# EAGLE schematic Schematic v39 (EAGLE 9.7.0)
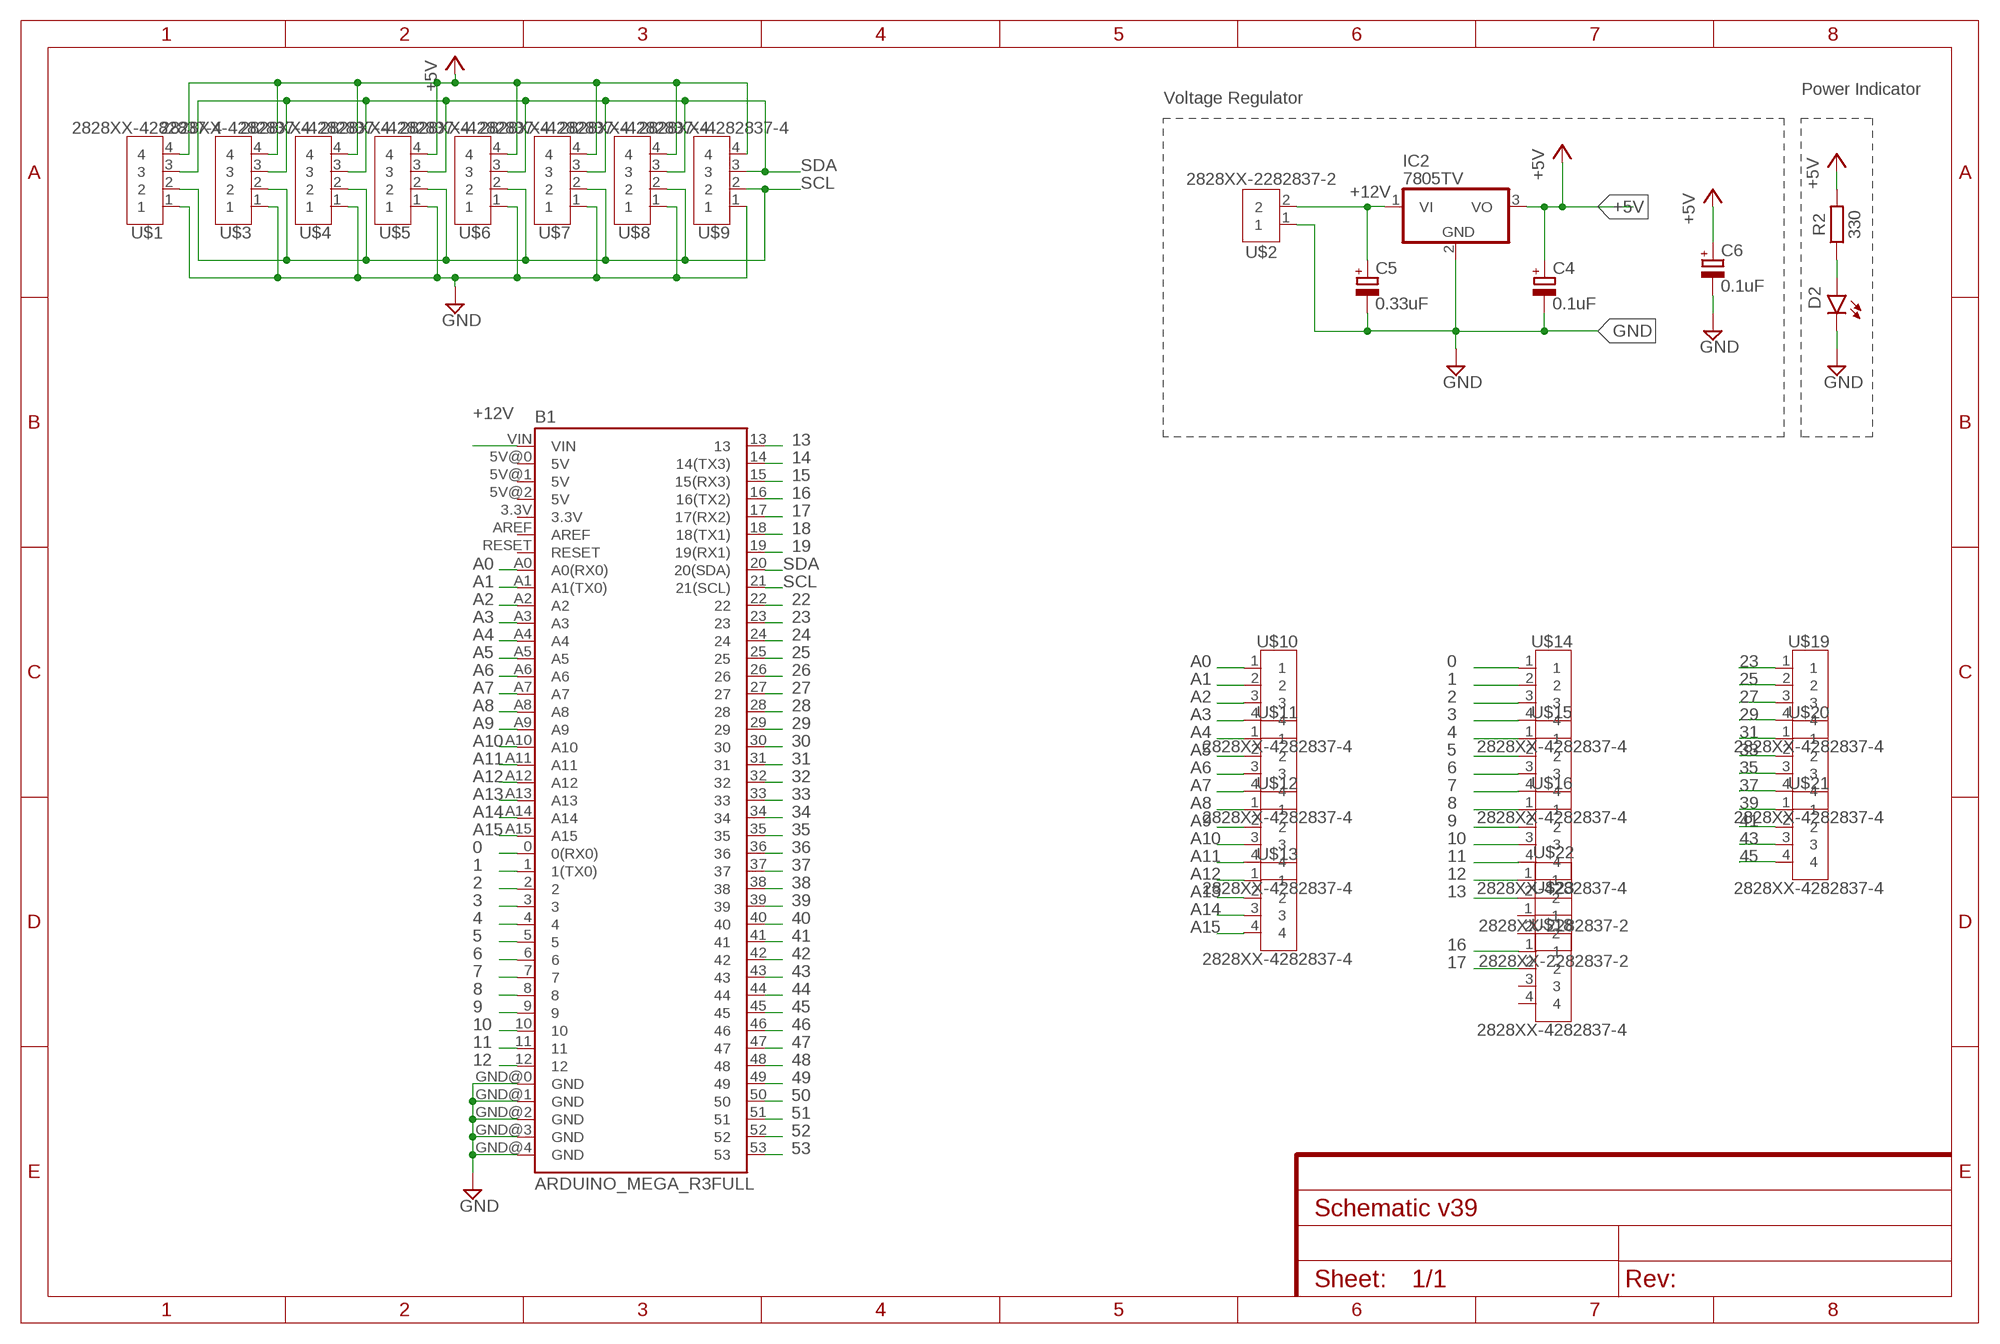
[diagram p0: schematic, sheet 1]

## Parts
B1  ARDUINO_MEGA_R3FULL  [ARDUINO_MEGA]
C4  0.1uF  C-POL_RADIAL-11MM-DIA  [CAPPRD508W65D1000H1100B]
C5  0.33uF  C-POL_RADIAL-25MM-DIA  [CAPPRD550W110D1250H2500B]
C6  0.1uF  C-POL_RADIAL-11MM-DIA  [CAPPRD508W65D1000H1100B]
D2  LED_ORANGE  LED_RADIAL_ORANGE  [LEDRD254W60D565H860B_O]
IC2  7805TV  [TO220V]
R2  330  R_AXIAL-7.2MM-PITCH  [RESAD724W46L381D178B]
U$1  2828XX-4282837-4  [TERMBLK_508-4N]
U$2  2828XX-2282837-2  [TERMBLK_508-2N]
U$3  2828XX-4282837-4  [TERMBLK_508-4N]
U$4  2828XX-4282837-4  [TERMBLK_508-4N]
U$5  2828XX-4282837-4  [TERMBLK_508-4N]
U$6  2828XX-4282837-4  [TERMBLK_508-4N]
U$7  2828XX-4282837-4  [TERMBLK_508-4N]
U$8  2828XX-4282837-4  [TERMBLK_508-4N]
U$9  2828XX-4282837-4  [TERMBLK_508-4N]
U$10  2828XX-4282837-4  [TERMBLK_508-4N]
U$11  2828XX-4282837-4  [TERMBLK_508-4N]
U$12  2828XX-4282837-4  [TERMBLK_508-4N]
U$13  2828XX-4282837-4  [TERMBLK_508-4N]
U$14  2828XX-4282837-4  [TERMBLK_508-4N]
U$15  2828XX-4282837-4  [TERMBLK_508-4N]
U$16  2828XX-4282837-4  [TERMBLK_508-4N]
U$18  2828XX-4282837-4  [TERMBLK_508-4N]
U$19  2828XX-4282837-4  [TERMBLK_508-4N]
U$20  2828XX-4282837-4  [TERMBLK_508-4N]
U$21  2828XX-4282837-4  [TERMBLK_508-4N]
U$22  2828XX-2282837-2  [TERMBLK_508-2N]
U$23  2828XX-2282837-2  [TERMBLK_508-2N]

## Nets
0: B1.0(0(RX0)) U$14.1
1: B1.1(1(TX0)) U$14.2
2: B1.2 U$14.3
3: B1.3 U$14.4
4: B1.4 U$15.1
5: B1.5 U$15.2
6: B1.6 U$15.3
7: B1.7 U$15.4
8: B1.8 U$16.1
9: B1.9 U$16.2
10: B1.10 U$16.3
11: B1.11 U$16.4
12: B1.12 U$22.1
13: B1.13 U$22.2
14: B1.14(14(TX3))
15: B1.15(15(RX3))
16: B1.16(16(TX2)) U$18.1
17: B1.17(17(RX2)) U$18.2
18: B1.18(18(TX1))
19: B1.19(19(RX1))
22: B1.22
23: B1.23 U$19.1
24: B1.24
25: B1.25 U$19.2
26: B1.26
27: B1.27 U$19.3
28: B1.28
29: B1.29 U$19.4
30: B1.30
31: B1.31 U$20.1
32: B1.32
33: B1.33 U$20.2
34: B1.34
35: B1.35 U$20.3
36: B1.36
37: B1.37 U$20.4
38: B1.38
39: B1.39 U$21.1
40: B1.40
41: B1.41 U$21.2
42: B1.42
43: B1.43 U$21.3
44: B1.44
45: B1.45 U$21.4
46: B1.46
47: B1.47
48: B1.48
49: B1.49
50: B1.50
51: B1.51
52: B1.52
53: B1.53
+5V: C4.1(+) C6.1(+) IC2.3(VO) R2.2 U$1.4 U$3.4 U$4.4 U$5.4 U$6.4 U$7.4 U$8.4 U$9.4
+12V: B1.VIN C5.1(+) IC2.1(VI) U$2.2
A0: B1.A0(A0(RX0)) U$10.1
A1: B1.A1(A1(TX0)) U$10.2
A2: B1.A2 U$10.3
A3: B1.A3 U$10.4
A4: B1.A4 U$11.1
A5: B1.A5 U$11.2
A6: B1.A6 U$11.3
A7: B1.A7 U$11.4
A8: B1.A8 U$12.1
A9: B1.A9 U$12.2
A10: B1.A10 U$12.3
A11: B1.A11 U$12.4
A12: B1.A12 U$13.1
A13: B1.A13 U$13.2
A14: B1.A14 U$13.3
A15: B1.A15 U$13.4
GND: B1.GND@0(GND) B1.GND@1(GND) B1.GND@2(GND) B1.GND@3(GND) B1.GND@4(GND) C4.2(-) C5.2(-) C6.2(-) D2.2(C) IC2.2(GND) U$1.1 U$2.1 U$3.1 U$4.1 U$5.1 U$6.1 U$7.1 U$8.1 U$9.1
N$1: D2.1(A) R2.1
SCL: B1.21(21(SCL)) U$1.2 U$3.2 U$4.2 U$5.2 U$6.2 U$7.2 U$8.2 U$9.2
SDA: B1.20(20(SDA)) U$1.3 U$3.3 U$4.3 U$5.3 U$6.3 U$7.3 U$8.3 U$9.3
Unconnected: B1.3.3V B1.5V@0(5V) B1.5V@1(5V) B1.5V@2(5V) B1.AREF B1.RESET U$18.3 U$18.4 U$23.1 U$23.2

## Notes on the sheet
- Power Indicator
- Voltage Regulator

## Library data of the parts
B1 = SparkFun-Boards:ARDUINO_MEGA_R3: Arduino Mega R3 ATmega2560 R3 compatible footprint. SparkFun Products: Arduino Mega 2560 R3 <https://www.sparkfun.com/products/11061>
C4-C6 = Capacitor:C-POL: Capacitor Polarised - Generic; CATEGORY: Capacitor
D2 = Tinkercad:LED_RADIAL: LED - Generic; CATEGORY: Opto-Electronic; SUB-CATEGORY: LED
IC2 = linear:78*: Positive VOLTAGE REGULATOR Source: http://cache.national.com/ds/LM/LM78L05.pdf http://www.fairchildsemi.com/ds/LM/LM7805.pdf
R2 = Resistor:R: Resistor Fixed - Generic; CATEGORY: Resistor; SUB-CATEGORY: Fixed
U$1 U$3-U$16 U$18-U$21 = Connector:2828XX-4: 4 Position Wire to Board Terminal Block Horizontal with Board Datasheet <https://www.te.com.cn/commerce/DocumentDelivery/DDEController?Action=showdoc&DocId=Catalog+Section%7F1308389_EUROSTYLE_TERMINAL_BLOCKS%7F0607%7Fpdf%7FEnglish%7FENG_CS_1308389_EUROSTYLE_TERMINAL_BLOCKS_0607.pdf%7F2-282837-5>; CATEGORY: Connector; DESCRIPTION: TERM BLK 4P SIDE ENT 5.08mm PCB; MANUFACTURER: TE Connectivity; MPN: 282837-4; OPERATING_TEMPERATURE: 40°C to +105°C; PART_STATUS: Active; ROHS_COMPLIANCE: RoHS Compliant; SERIES: 283737; SUBCATEGORY: Terminal Block; TYPE: Side Wire Entry
U$2 = Connector:2828XX-2: 2 Position Wire to Board Terminal Block Horizontal with Board Datasheet <https://www.te.com.cn/commerce/DocumentDelivery/DDEController?Action=showdoc&DocId=Catalog+Section%7F1308389_EUROSTYLE_TERMINAL_BLOCKS%7F0607%7Fpdf%7FEnglish%7FENG_CS_1308389_EUROSTYLE_TERMINAL_BLOCKS_0607.pdf%7F2-282837-5>; CATEGORY: Connector; DESCRIPTION: 2 Position Wire to Board Terminal Block Horizontal with Board 5.08 mm Through Hole; MANUFACTURER: TE Connectivity; MPN: 282837-2; OPERATING_TEMPERATURE: -40°C to +105°C; PART_STATUS: ACTIVE; ROHS_COMPLIANCE: RoHS Compliant; SERIES: 282837; SPICEPREFIX: B; SUBCATEGORY: Terminal Block; TYPE: Side Wire Entry
U$22 U$23 = Connector:2828XX-2: 2 Position Wire to Board Terminal Block Horizontal with Board Datasheet <https://www.te.com.cn/commerce/DocumentDelivery/DDEController?Action=showdoc&DocId=Catalog+Section%7F1308389_EUROSTYLE_TERMINAL_BLOCKS%7F0607%7Fpdf%7FEnglish%7FENG_CS_1308389_EUROSTYLE_TERMINAL_BLOCKS_0607.pdf%7F2-282837-5>; CATEGORY: Connector; DESCRIPTION: 2 Position Wire to Board Terminal Block Horizontal with Board 5.08 mm Through Hole; MANUFACTURER: TE Connectivity; MPN: 282837-2; OPERATING_TEMPERATURE: -40°C to +105°C; PART_STATUS: ACTIVE; ROHS_COMPLIANCE: RoHS Compliant; SERIES: 282837; SUBCATEGORY: Terminal Block; TYPE: Side Wire Entry